# Altium project Arduino.PrjPcb
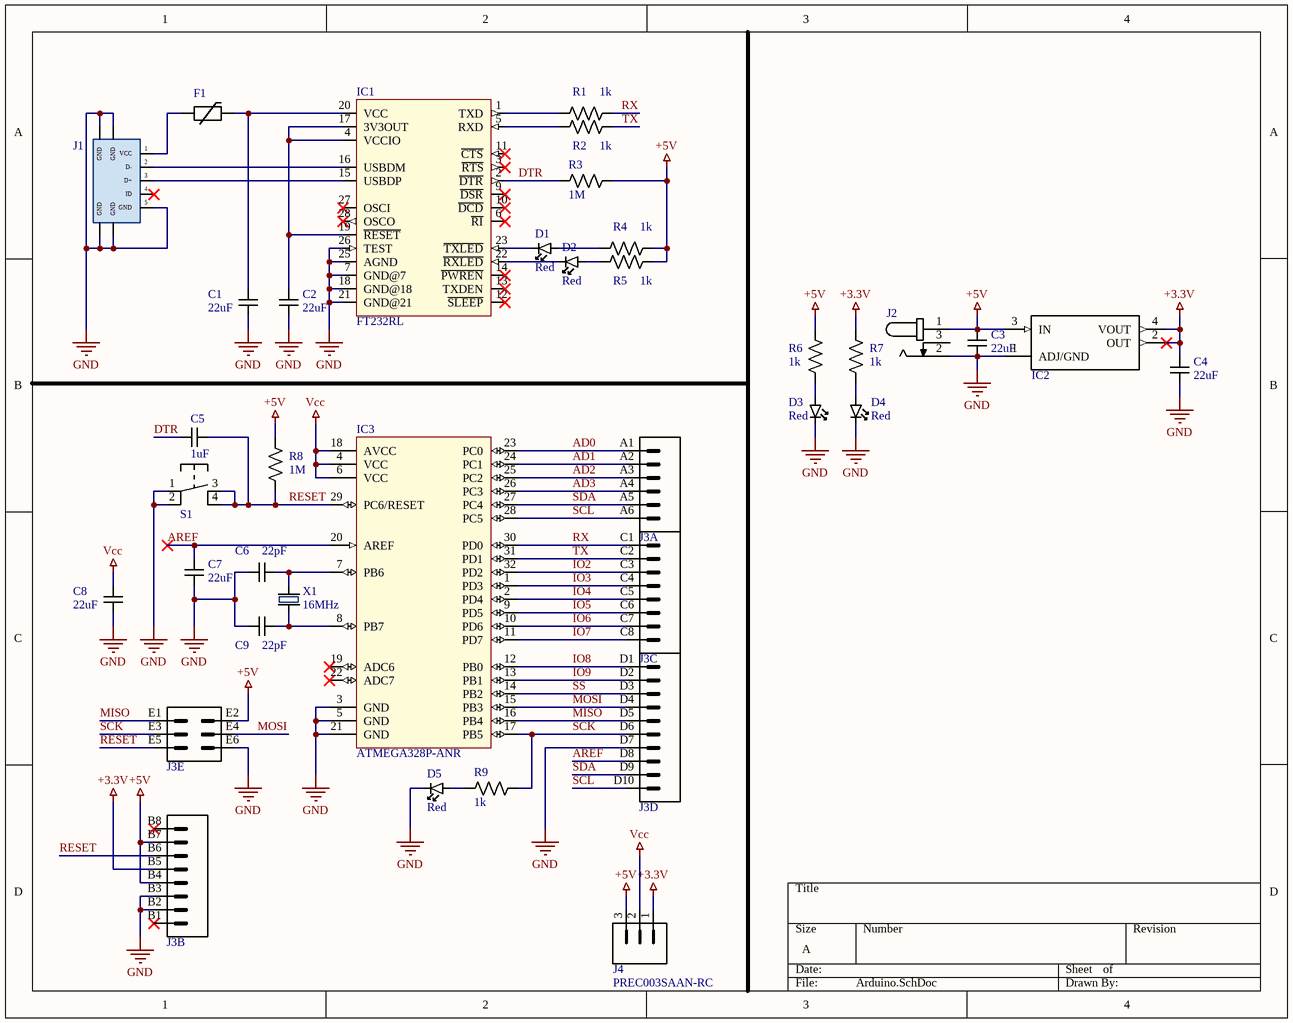
[diagram p0: Arduino.SchDoc]
1 sheet, 33 parts. Net scope: global (net labels, ports and power ports of the same name join across sheets).
Board file: Arduino.PcbDoc

## Sheet Arduino.SchDoc
size A

### Parts
C1  22uF  [CAP1206]
C2  22uF  [CAP1206]
C3  22uF  [CAP1206]
C4  22uF  [CAP1206]
C5  1uF  [CAP1206]
C6  22pF  [CAP1206]
C7  22uF  [CAP1206]
C8  22uF  [CAP1206]
C9  22pF  [CAP1206]
D1  Red  [LED]
D2  Red  [LED]
D3  Red  [LED]
D4  Red  [LED]
D5  Red  [LED]
F1  MF-MSMF050-2  [FUSE]  (value not drawn)
IC1  FT232RL  [SSOP-28]
IC2  AZ1117CH-3.3TRG1  [SOT223]  (value not drawn)
IC3  ATMEGA328P-ANR  [TQFP]
J1  XM7D-0512  [XM7D-0512]  (value not drawn)
J2  Power Jack  [Power_Jack]  (value not drawn)
J3  Arduino_Shield  [ARDUINO_SHIELD]  (value not drawn)  (parts A,B,C,D,E of 5)
J4  PREC003SAAN-RC  [3_PIN]
R1  1k  [RES1206]
R2  1k  [RES1206]
R3  1M  [RES1206]
R4  1k  [RES1206]
R5  1k  [RES1206]
R6  1k  [RES1206]
R7  1k  [RES1206]
R8  1M  [RES1206]
R9  1k  [RES1206]
S1  TL3305AF160QG  [Switch]  (value not drawn)
X1  16MHz  [Crystal]

### Nets
+3.3V: C4.2 IC2.2(OUT) IC2.4(VOUT) J3.B5 J4.1 R7.2
+5V: C3.1 IC2.3(IN) J2.1 J3.B4 J3.B7 J3.E2 J4.3 R3.1 R4.2 R5.2 R6.2 R8.2
GND: C1.1 C2.1 C3.2 C4.1 C6.1 C7.1 C8.1 C9.1 D3.1 D4.1 D5.1 IC1.7(GND@7) IC1.18(GND@18) IC1.21(GND@21) IC1.25(AGND) IC1.26(TEST) IC2.1(ADJ/GND) IC3.3(GND) IC3.5(GND) IC3.21(GND) J1.5(GND) J1.SH1(GND) J1.SH2(GND) J1.SH3(GND) J1.SH4(GND) J2.2 J3.B2 J3.B3 J3.D7 J3.E6 S1.1 S1.2
Vcc: C8.2 IC3.4(VCC) IC3.6(VCC) IC3.18(AVCC) J4.2
AD0: IC3.23(PC0) J3.A1
AD1: IC3.24(PC1) J3.A2
AD2: IC3.25(PC2) J3.A3
AD3: IC3.26(PC3) J3.A4
AREF: C7.2 IC3.20(AREF) J3.D8
DTR: C5.1 IC1.2(~{DTR}) R3.2
IO2: IC3.32(PD2) J3.C3
IO3: IC3.1(PD3) J3.C4
IO4: IC3.2(PD4) J3.C5
IO5: IC3.9(PD5) J3.C6
IO6: IC3.10(PD6) J3.C7
IO7: IC3.11(PD7) J3.C8
IO8: IC3.12(PB0) J3.D1
IO9: IC3.13(PB1) J3.D2
MISO: IC3.16(PB4) J3.D5 J3.E1
MOSI: IC3.15(PB3) J3.D4 J3.E4
RESET: C5.2 IC3.29(PC6/RESET) J3.B6 J3.E5 R8.1 S1.3 S1.4
RX: IC3.30(PD0) J3.C1 R1.2
SCK: IC3.17(PB5) J3.D6 J3.E3 R9.2
SCL: IC3.28(PC5) J3.A6 J3.D10
SDA: IC3.27(PC4) J3.A5 J3.D9
SS: IC3.14(PB2) J3.D3
TX: IC3.31(PD1) J3.C2 R2.2
NetC1_2: C1.2 F1.2 IC1.20(VCC)
NetC2_2: C2.2 IC1.4(VCCIO) IC1.17(3V3OUT) IC1.19(~{RESET})
NetC6_2: C6.2 IC3.7(PB6) X1.2
NetC9_2: C9.2 IC3.8(PB7) X1.1
NetD1_1: D1.1 IC1.23(~{TXLED})
NetD1_2: D1.2 R4.1
NetD2_1: D2.1 IC1.22(~{RXLED})
NetD2_2: D2.2 R5.1
NetD3_2: D3.2 R6.1
NetD4_2: D4.2 R7.1
NetD5_2: D5.2 R9.1
NetF1_1: F1.1 J1.1(VCC)
NetIC1_1: IC1.1(TXD) R1.1
NetIC1_5: IC1.5(RXD) R2.1
NetIC1_15: IC1.15(USBDP) J1.3(D+)
NetIC1_16: IC1.16(USBDM) J1.2(D-)

Not connected (* = marked no-connect by the designer): IC1 3(~{RTS})* 6(~{RI})* 9(~{DSR})* 10(~{DCD})* 11(~{CTS})* 12(~{SLEEP})* 13(TXDEN)* 14(~{PWREN})* 27(OSCI)* 28(OSCO)*; IC3 19(ADC6)* 22(ADC7)*; J1 4(ID)*; J2 3; J3 B1(1)* B8(8)*

### Library data of the parts
C1-C4 C7 C8 = 1206_22uF: 22µF ±20% 16V Ceramic Capacitor X5R 1206 (3216 Metric); Value: CAP CER 22UF 16V X5R 1206; Digikey Link: https://www.digikey.com/product-detail/en/CL31A226MOCLNNC/1276-2728-1-ND/3890814/?itemSeq=304982363; Digikey Part: 1276-2728-1-ND
C5 = 1206_1uF: 1µF ±20% 16V Ceramic Capacitor X7R 1206 (3216 Metric); Value: CAP CER 1UF 16V X7R 1206; Digikey Link: https://www.digikey.com/product-detail/en/C1206C105M4RACTU/399-8150-1-ND/3471873/?itemSeq=304982366; Digikey Part: 399-8150-1-ND
C6 C9 = 1206_22pF: 22pF ±5% 16V Ceramic Capacitor C0G, NP0 1206 (3216 Metric); Value: CAP CER 22PF 16V C0G/NP0 1206; Digikey Link: https://www.digikey.com/product-detail/en/885012008011/732-7867-1-ND/5454494/?itemSeq=304982362; Digikey Part: 732-7867-1-ND
D1-D5 = 1206_RED_LED: Red 638nm LED Indication - Discrete 1.8V 1206 (3216 Metric); Value: LED RED CLEAR 1206 SMD; Digikey Link: https://www.digikey.com/product-detail/en/LTST-C150CKT/160-1167-1-ND/269239/?itemSeq=304982368; Digikey Part: 160-1167-1-ND
F1 = Fuse: Polymeric PTC Resettable Fuse 15V 500mA Ih Surface Mount 1812 (4532 Metric), Concave; Value: PTC RESET FUSE 15V 500MA 1812; Digikey Link: https://www.digikey.com/product-detail/en/MF-MSMF050-2/MF-MSMF050-2CT-ND/662842/?itemSeq=304982360; Digikey Part: MF-MSMF050-2CT-ND
IC1 = FTDI: USB Bridge, USB to UART USB 2.0 UART Interface 28-SSOP; Value: IC USB FS SERIAL UART 28-SSOP; Digikey Part: 768-1007-1-ND; Digikey Link: https://www.digikey.com/product-detail/en/FT232RL-REEL/768-1007-1-ND/1836402/?itemSeq=304982359
IC2 = 3.3V_LDO: Linear Voltage Regulator IC Positive Fixed 1 Output 1A SOT-223; Value: IC REG LINEAR 3.3V 800MA SOT223; Digikey Link: https://www.digikey.com/product-detail/en/AZ1117CH-3.3TRG1/AZ1117CH-3.3TRG1DICT-ND/4505206/?itemSeq=304982370; Digikey Part: AZ1117CH-3.3TRG1DICT-ND
IC3 = ATMega328P: AVR AVR® ATmega Microcontroller IC 8-Bit 20MHz 32KB (16K x 16) FLASH 32-TQFP (7x7); Value: IC MCU 8BIT 32KB FLASH 32TQFP; Digikey Link: https://www.digikey.com/product-detail/en/ATMEGA328P-ANR/ATMEGA328P-ANRCT-ND/2774230/?itemSeq=304982365; Digikey Part: ATMEGA328P-ANRCT-ND
J1 = USB: USB - mini B USB 2.0 Receptacle Connector 5 Position Through Hole, Right Angle; Value: CONN RCPT USB2.0 MINI B 5P R/A; Digikey Link: https://www.digikey.com/product-detail/en/XM7D-0512/OR1205-ND/4695531/?itemSeq=304982356; Digikey Part: OR1205-ND
J2 = Power Jack: Power Barrel Connector Jack 2.10mm ID (0.083"), 5.50mm OD (0.217") Through Hole, Right Angle; Value: CONN PWR JACK 2X5.5MM SOLDER; Digikey Link: https://www.digikey.com/product-detail/en/PJ-102A/CP-102A-ND/275425/?itemSeq=304982367; Digikey Part: CP-102A-ND
J4 = 3_PIN: Connector Header Through Hole 3 position 0.100" (2.54mm); Value: CONN HEADER VERT 3POS 2.54MM; Digikey Link: https://www.digikey.com/product-detail/en/PREC003SAAN-RC/S1012EC-03-ND/2774851/?itemSeq=304982371; Digikey Part: S1012EC-03-ND
R1 R2 R4-R7 R9 = 1206_1K: 1 kOhms ±1% 0.5W, 1/2W Chip Resistor 1206 (3216 Metric) Anti-Sulfur, Moisture Resistant Thin Film; Value: RES 1K OHM 1% 1/2W 1206; Digikey Link: https://www.digikey.com/product-detail/en/RNCP1206FTD1K00/RNCP1206FTD1K00CT-ND/2240675/?itemSeq=304982373; Digikey Part: RNCP1206FTD1K00CT-ND
R3 R8 = 1206_1M: 1 MOhms ±5% 0.25W, 1/4W Chip Resistor 1206 (3216 Metric) Automotive AEC-Q200 Thick Film; Value: RES 1M OHM 5% 1/4W 1206; Digikey Link: https://www.digikey.com/product-detail/en/RMCF1206JT1M00/RMCF1206JT1M00CT-ND/1942830/?itemSeq=304982358; Digikey Part: Number RMCF1206JT1M00CT-ND
S1 = Push_Button: Tactile Switch SPST-NO Top Actuated Surface Mount; Value: SWITCH TACTILE SPST-NO 50MA 12V; Digikey Link: https://www.digikey.com/product-detail/en/TL3305AF160QG/EG5350CT-ND/5816195/?itemSeq=304982361; Digikey Part: EG5350CT-ND
X1 = 16MHz_Crystal: 16MHz ±30ppm Crystal 18pF 40 Ohms HC-49/US; Value: CRYSTAL 16.0000MHZ 18PF SMD; Digikey Link: https://www.digikey.com/product-detail/en/ABLS-16.000MHZ-B4-T/535-10226-1-ND/2184261/?itemSeq=304982364; Digikey Part: 535-10226-1-ND